# Altium schematic sheet MicroController.SchDoc
size OrCAD B; SheetNumber: 11; SheetTotal: 11
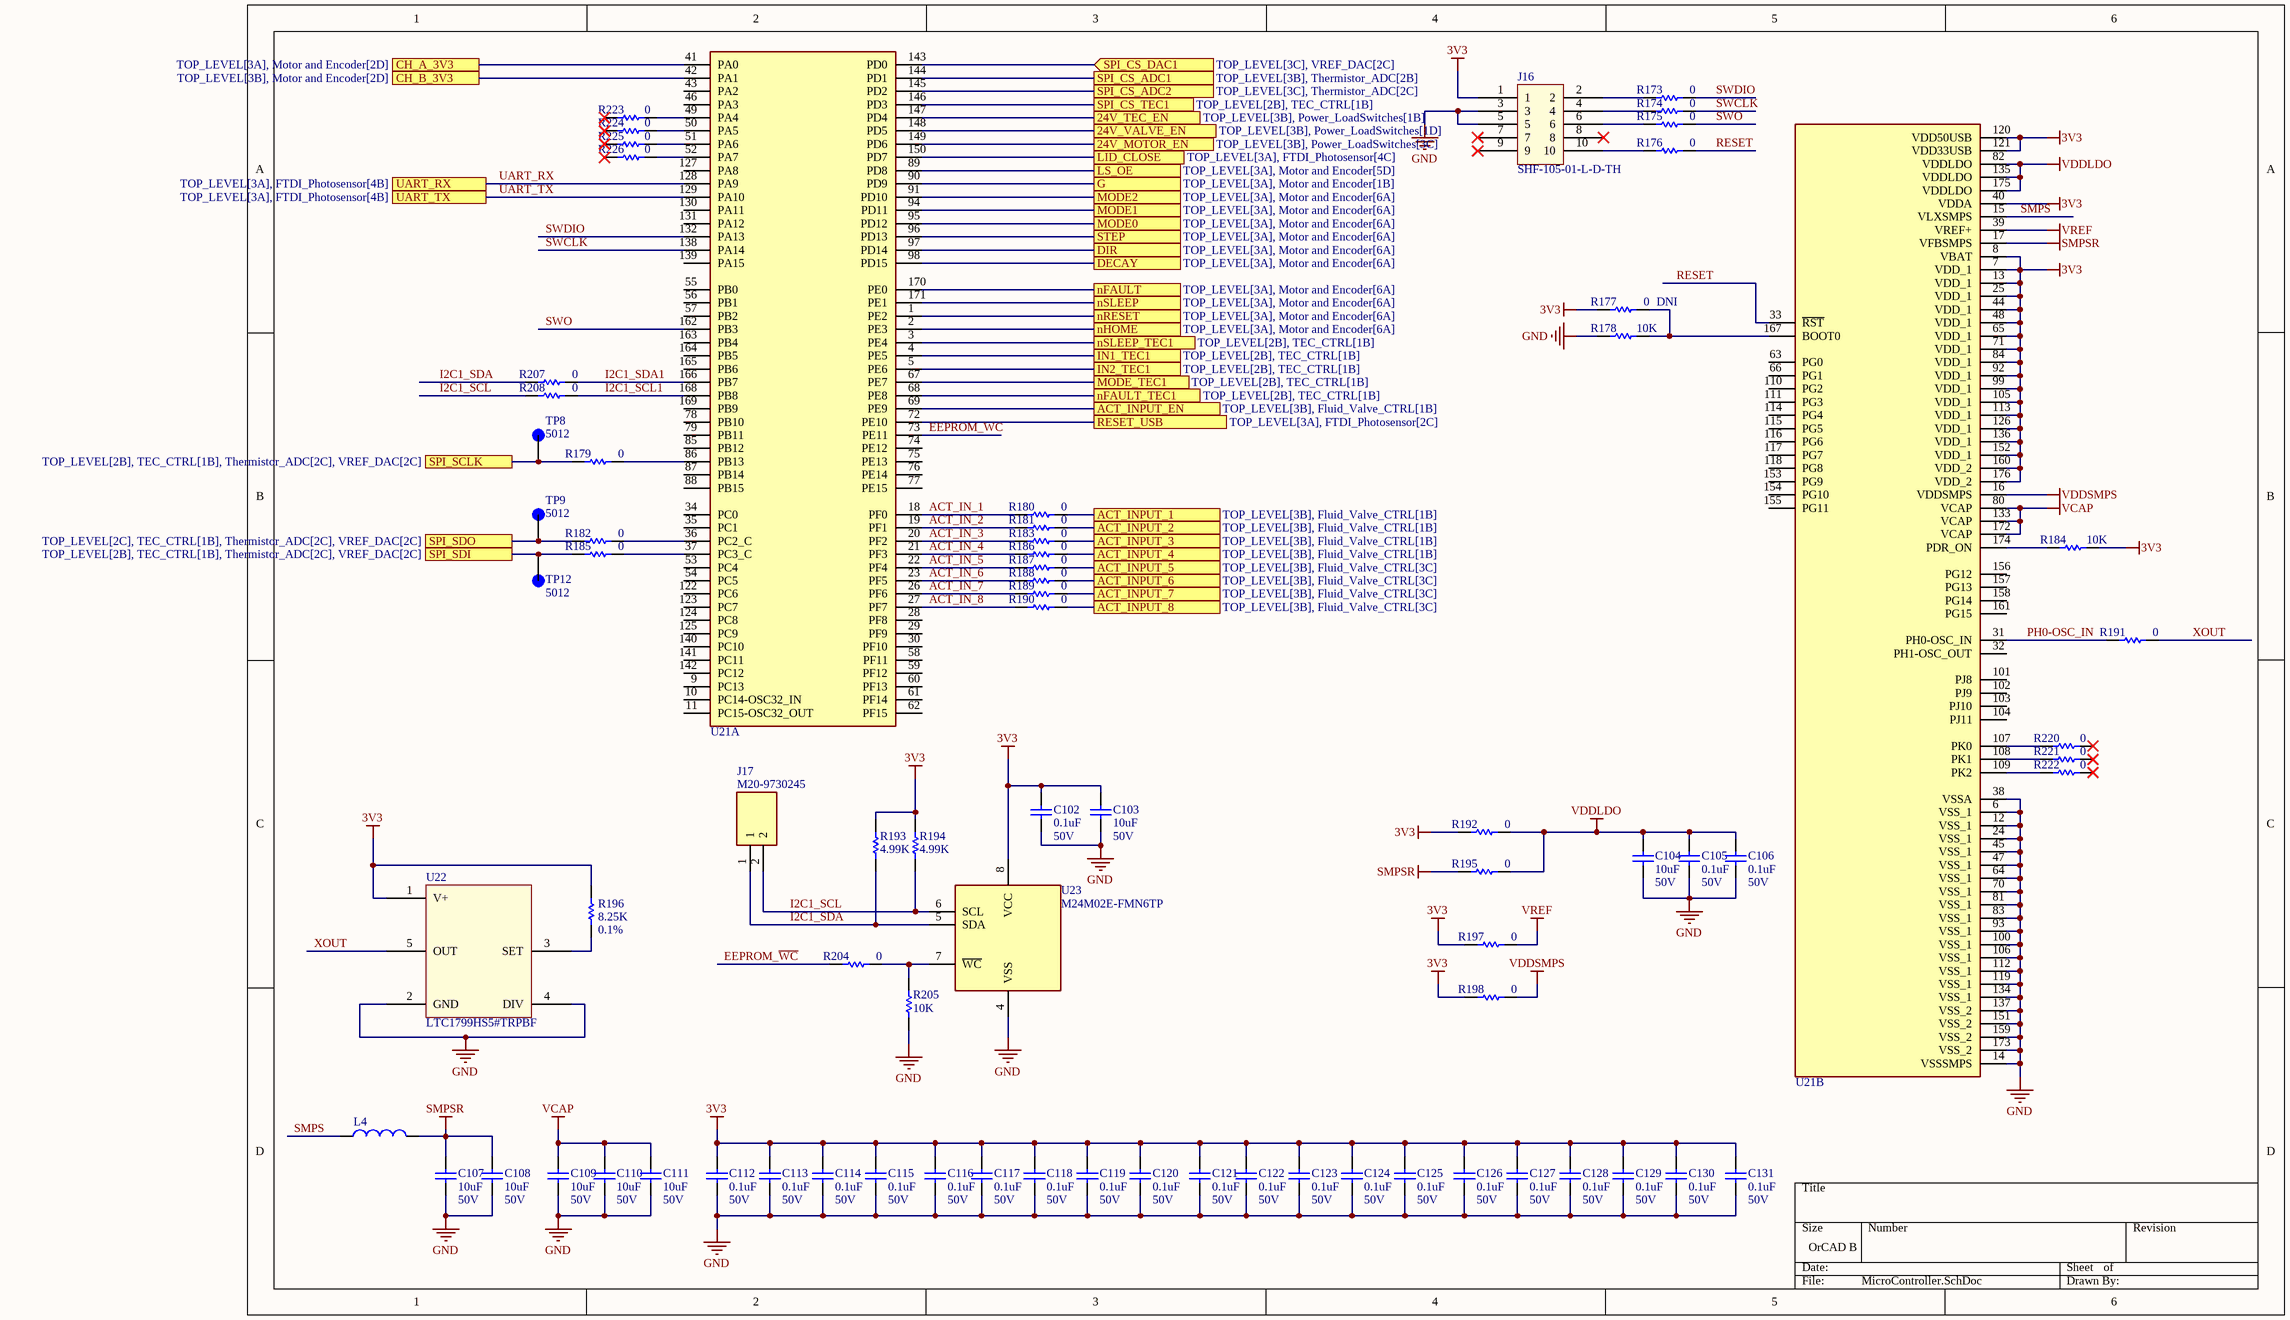
[diagram p0: MicroController.SchDoc]

## Parts
C102  value 0.1uF  Rating: 50V  [DEFAULT_CAPACITOR_0805]  (hidden comment: KGM21NR71H104KT)
C103  value 10uF  Rating: 50V  [DEFAULT_CAPACITOR_0805]  (hidden comment: GRM21BR61H106KE43L)
C104  value 10uF  Rating: 50V  [DEFAULT_CAPACITOR_0805]  (hidden comment: GRM21BR61H106KE43L)
C105  value 0.1uF  Rating: 50V  [DEFAULT_CAPACITOR_0805]  (hidden comment: KGM21NR71H104KT)
C106  value 0.1uF  Rating: 50V  [DEFAULT_CAPACITOR_0805]  (hidden comment: KGM21NR71H104KT)
C107  value 10uF  Rating: 50V  [DEFAULT_CAPACITOR_0805]  (hidden comment: GRM21BR61H106KE43L)
C108  value 10uF  Rating: 50V  [DEFAULT_CAPACITOR_0805]  (hidden comment: GRM21BR61H106KE43L)
C109  value 10uF  Rating: 50V  [DEFAULT_CAPACITOR_0805]  (hidden comment: GRM21BR61H106KE43L)
C110  value 10uF  Rating: 50V  [DEFAULT_CAPACITOR_0805]  (hidden comment: GRM21BR61H106KE43L)
C111  value 10uF  Rating: 50V  [DEFAULT_CAPACITOR_0805]  (hidden comment: GRM21BR61H106KE43L)
C112  value 0.1uF  Rating: 50V  [DEFAULT_CAPACITOR_0805]  (hidden comment: KGM21NR71H104KT)
C113  value 0.1uF  Rating: 50V  [DEFAULT_CAPACITOR_0805]  (hidden comment: KGM21NR71H104KT)
C114  value 0.1uF  Rating: 50V  [DEFAULT_CAPACITOR_0805]  (hidden comment: KGM21NR71H104KT)
C115  value 0.1uF  Rating: 50V  [DEFAULT_CAPACITOR_0805]  (hidden comment: KGM21NR71H104KT)
C116  value 0.1uF  Rating: 50V  [DEFAULT_CAPACITOR_0805]  (hidden comment: KGM21NR71H104KT)
C117  value 0.1uF  Rating: 50V  [DEFAULT_CAPACITOR_0805]  (hidden comment: KGM21NR71H104KT)
C118  value 0.1uF  Rating: 50V  [DEFAULT_CAPACITOR_0805]  (hidden comment: KGM21NR71H104KT)
C119  value 0.1uF  Rating: 50V  [DEFAULT_CAPACITOR_0805]  (hidden comment: KGM21NR71H104KT)
C120  value 0.1uF  Rating: 50V  [DEFAULT_CAPACITOR_0805]  (hidden comment: KGM21NR71H104KT)
C121  value 0.1uF  Rating: 50V  [DEFAULT_CAPACITOR_0805]  (hidden comment: KGM21NR71H104KT)
C122  value 0.1uF  Rating: 50V  [DEFAULT_CAPACITOR_0805]  (hidden comment: KGM21NR71H104KT)
C123  value 0.1uF  Rating: 50V  [DEFAULT_CAPACITOR_0805]  (hidden comment: KGM21NR71H104KT)
C124  value 0.1uF  Rating: 50V  [DEFAULT_CAPACITOR_0805]  (hidden comment: KGM21NR71H104KT)
C125  value 0.1uF  Rating: 50V  [DEFAULT_CAPACITOR_0805]  (hidden comment: KGM21NR71H104KT)
C126  value 0.1uF  Rating: 50V  [DEFAULT_CAPACITOR_0805]  (hidden comment: KGM21NR71H104KT)
C127  value 0.1uF  Rating: 50V  [DEFAULT_CAPACITOR_0805]  (hidden comment: KGM21NR71H104KT)
C128  value 0.1uF  Rating: 50V  [DEFAULT_CAPACITOR_0805]  (hidden comment: KGM21NR71H104KT)
C129  value 0.1uF  Rating: 50V  [DEFAULT_CAPACITOR_0805]  (hidden comment: KGM21NR71H104KT)
C130  value 0.1uF  Rating: 50V  [DEFAULT_CAPACITOR_0805]  (hidden comment: KGM21NR71H104KT)
C131  value 0.1uF  Rating: 50V  [DEFAULT_CAPACITOR_0805]  (hidden comment: KGM21NR71H104KT)
J16  SHF-105-01-L-D-TH  [SAMTEC-SHF-105-01-L-D-TH]
J17  M20-9730245  [M209730245]
L4  LQM2MPN2R2MG0L  [INDC2016X100N]  (value not drawn)
R173  value 0  [DEFAULT_RESISTOR_0805]  (hidden comment: RC0805JR-070RL)
R174  value 0  [DEFAULT_RESISTOR_0805]  (hidden comment: RC0805JR-070RL)
R175  value 0  [DEFAULT_RESISTOR_0805]  (hidden comment: RC0805JR-070RL)
R176  value 0  [DEFAULT_RESISTOR_0805]  (hidden comment: RC0805JR-070RL)
R177  DNI  value 0  [DEFAULT_RESISTOR_0805]
R178  value 10K  [DEFAULT_RESISTOR_0805]  (hidden comment: CRCW080510K0FKEA)
R179  value 0  [DEFAULT_RESISTOR_0805]  (hidden comment: RC0805JR-070RL)
R180  value 0  [DEFAULT_RESISTOR_0805]  (hidden comment: RC0805JR-070RL)
R181  value 0  [DEFAULT_RESISTOR_0805]  (hidden comment: RC0805JR-070RL)
R182  value 0  [DEFAULT_RESISTOR_0805]  (hidden comment: RC0805JR-070RL)
R183  value 0  [DEFAULT_RESISTOR_0805]  (hidden comment: RC0805JR-070RL)
R184  value 10K  [DEFAULT_RESISTOR_0805]  (hidden comment: CRCW080510K0FKEA)
R185  value 0  [DEFAULT_RESISTOR_0805]  (hidden comment: RC0805JR-070RL)
R186  value 0  [DEFAULT_RESISTOR_0805]  (hidden comment: RC0805JR-070RL)
R187  value 0  [DEFAULT_RESISTOR_0805]  (hidden comment: RC0805JR-070RL)
R188  value 0  [DEFAULT_RESISTOR_0805]  (hidden comment: RC0805JR-070RL)
R189  value 0  [DEFAULT_RESISTOR_0805]  (hidden comment: RC0805JR-070RL)
R190  value 0  [DEFAULT_RESISTOR_0805]  (hidden comment: RC0805JR-070RL)
R191  value 0  [DEFAULT_RESISTOR_0805]  (hidden comment: RC0805JR-070RL)
R192  value 0  [DEFAULT_RESISTOR_0805]  (hidden comment: RC0805JR-070RL)
R193  value 4.99K  [DEFAULT_RESISTOR_0805]  (hidden comment: RMCF0805FT4K99)
R194  value 4.99K  [DEFAULT_RESISTOR_0805]  (hidden comment: RMCF0805FT4K99)
R195  value 0  [DEFAULT_RESISTOR_0805]  (hidden comment: RC0805JR-070RL)
R196  value 8.25K  Tolerance: 0.1%  [DEFAULT_RESISTOR_0805]  (hidden comment: ERA-6AEB8251V)
R197  value 0  [DEFAULT_RESISTOR_0805]  (hidden comment: RC0805JR-070RL)
R198  value 0  [DEFAULT_RESISTOR_0805]  (hidden comment: RC0805JR-070RL)
R204  value 0  [DEFAULT_RESISTOR_0805]  (hidden comment: RC0805JR-070RL)
R205  value 10K  [DEFAULT_RESISTOR_0805]  (hidden comment: CRCW080510K0FKEA)
R207  value 0  [DEFAULT_RESISTOR_0805]  (hidden comment: RC0805JR-070RL)
R208  value 0  [DEFAULT_RESISTOR_0805]  (hidden comment: RC0805JR-070RL)
R220  value 0  [DEFAULT_RESISTOR_0805]  (hidden comment: RC0805JR-070RL)
R221  value 0  [DEFAULT_RESISTOR_0805]  (hidden comment: RC0805JR-070RL)
R222  value 0  [DEFAULT_RESISTOR_0805]  (hidden comment: RC0805JR-070RL)
R223  value 0  [DEFAULT_RESISTOR_0805]  (hidden comment: RC0805JR-070RL)
R224  value 0  [DEFAULT_RESISTOR_0805]  (hidden comment: RC0805JR-070RL)
R225  value 0  [DEFAULT_RESISTOR_0805]  (hidden comment: RC0805JR-070RL)
R226  value 0  [DEFAULT_RESISTOR_0805]  (hidden comment: RC0805JR-070RL)
TP8  5012  [TP_5011]
TP9  5012  [TP_5011]
TP12  5012  [TP_5011]
U21  STM32H735IGT6  [STM32H7351GT6-LQFP176]  (value not drawn)  (parts A,B of 2)
U22  LTC1799HS5#TRPBF  [LTC1799HS5-TSOT23-5]
U23  M24M02E-FMN6TP  [8ld - SOIC]

## Ports
24V_MOTOR_EN (see TOP_LEVEL[3B], Power_LoadSwitches[3C]), 24V_TEC_EN (see TOP_LEVEL[3B], Power_LoadSwitches[1B]), 24V_VALVE_EN (see TOP_LEVEL[3B], Power_LoadSwitches[1D]), ACT_INPUT_1 (see TOP_LEVEL[3B], Fluid_Valve_CTRL[1B]), ACT_INPUT_2 (see TOP_LEVEL[3B], Fluid_Valve_CTRL[1B]), ACT_INPUT_3 (see TOP_LEVEL[3B], Fluid_Valve_CTRL[1B]), ACT_INPUT_4 (see TOP_LEVEL[3B], Fluid_Valve_CTRL[1B]), ACT_INPUT_5 (see TOP_LEVEL[3B], Fluid_Valve_CTRL[3C]), ACT_INPUT_6 (see TOP_LEVEL[3B], Fluid_Valve_CTRL[3C]), ACT_INPUT_7 (see TOP_LEVEL[3B], Fluid_Valve_CTRL[3C]), ACT_INPUT_8 (see TOP_LEVEL[3B], Fluid_Valve_CTRL[3C]), ACT_INPUT_EN (see TOP_LEVEL[3B], Fluid_Valve_CTRL[1B]), CH_A_3V3 (see TOP_LEVEL[3A], Motor and Encoder[2D]), CH_B_3V3 (see TOP_LEVEL[3B], Motor and Encoder[2D]), DECAY (see TOP_LEVEL[3A], Motor and Encoder[6A]), DIR (see TOP_LEVEL[3A], Motor and Encoder[6A]), G (see TOP_LEVEL[3A], Motor and Encoder[1B]), IN1_TEC1 (see TOP_LEVEL[2B], TEC_CTRL[1B]), IN2_TEC1 (see TOP_LEVEL[2B], TEC_CTRL[1B]), LID_CLOSE (see TOP_LEVEL[3A], FTDI_Photosensor[4C]), LS_OE (see TOP_LEVEL[3A], Motor and Encoder[5D]), MODE0 (see TOP_LEVEL[3A], Motor and Encoder[6A]), MODE1 (see TOP_LEVEL[3A], Motor and Encoder[6A]), MODE2 (see TOP_LEVEL[3A], Motor and Encoder[6A]), MODE_TEC1 (see TOP_LEVEL[2B], TEC_CTRL[1B]), nFAULT (see TOP_LEVEL[3A], Motor and Encoder[6A]), nFAULT_TEC1 (see TOP_LEVEL[2B], TEC_CTRL[1B]), nHOME (see TOP_LEVEL[3A], Motor and Encoder[6A]), nRESET (see TOP_LEVEL[3A], Motor and Encoder[6A]), nSLEEP (see TOP_LEVEL[3A], Motor and Encoder[6A]), nSLEEP_TEC1 (see TOP_LEVEL[2B], TEC_CTRL[1B]), RESET_USB (see TOP_LEVEL[3A], FTDI_Photosensor[2C]), SPI_CS_ADC1 (see TOP_LEVEL[3B], Thermistor_ADC[2B]), SPI_CS_ADC2 (see TOP_LEVEL[3C], Thermistor_ADC[2C]), SPI_CS_DAC1 (in, see TOP_LEVEL[3C], VREF_DAC[2C]), SPI_CS_TEC1 (see TOP_LEVEL[2B], TEC_CTRL[1B]), SPI_SCLK (see TOP_LEVEL[2B], TEC_CTRL[1B], Thermistor_ADC[2C], VREF_DAC[2C]), SPI_SDI (see TOP_LEVEL[2B], TEC_CTRL[1B], Thermistor_ADC[2C], VREF_DAC[2C]), SPI_SDO (see TOP_LEVEL[2C], TEC_CTRL[1B], Thermistor_ADC[2C], VREF_DAC[2C]), STEP (see TOP_LEVEL[3A], Motor and Encoder[6A]), UART_RX (see TOP_LEVEL[3A], FTDI_Photosensor[4B]), UART_TX (see TOP_LEVEL[3A], FTDI_Photosensor[4B])

## Nets
3V3: C102.2 C103.2 C112.2 C113.2 C114.2 C115.2 C116.2 C117.2 C118.2 C119.2 C120.2 C121.2 C122.2 C123.2 C124.2 C125.2 C126.2 C127.2 C128.2 C129.2 C130.2 C131.2 J16.1 R177.2 R184.1 R192.2 R193.1 R194.1 R196.1 R197.2 R198.2 U21.7(VDD_1) U21.8(VBAT) U21.13(VDD_1) U21.25(VDD_1) U21.40(VDDA) U21.44(VDD_1) U21.48(VDD_1) U21.65(VDD_1) U21.71(VDD_1) U21.84(VDD_1) U21.92(VDD_1) U21.99(VDD_1) U21.105(VDD_1) U21.113(VDD_1) U21.120(VDD50USB) U21.121(VDD33USB) U21.126(VDD_1) U21.136(VDD_1) U21.152(VDD_1) U21.160(VDD_2) U21.176(VDD_2) U22.1(V+) U23.8(VCC)
GND: C102.1 C103.1 C104.1 C105.1 C106.1 C107.1 C108.1 C109.1 C110.1 C111.1 C112.1 C113.1 C114.1 C115.1 C116.1 C117.1 C118.1 C119.1 C120.1 C121.1 C122.1 C123.1 C124.1 C125.1 C126.1 C127.1 C128.1 C129.1 C130.1 C131.1 J16.3 J16.5 R178.2 R205.2 U21.6(VSS_1) U21.12(VSS_1) U21.14(VSSSMPS) U21.24(VSS_1) U21.38(VSSA) U21.45(VSS_1) U21.47(VSS_1) U21.64(VSS_1) U21.70(VSS_1) U21.81(VSS_1) U21.83(VSS_1) U21.93(VSS_1) U21.100(VSS_1) U21.106(VSS_1) U21.112(VSS_1) U21.119(VSS_1) U21.134(VSS_1) U21.137(VSS_2) U21.151(VSS_2) U21.159(VSS_2) U21.173(VSS_2) U22.2(GND) U22.4(DIV) U23.4(VSS)
SMPSR: C107.2 C108.2 L4.2 R195.2 U21.17(VFBSMPS)
VCAP: C109.2 C110.2 C111.2 U21.80(VCAP) U21.133(VCAP) U21.172(VCAP)
VDDLDO: C104.2 C105.2 C106.2 R192.1 R195.1 U21.82(VDDLDO) U21.135(VDDLDO) U21.175(VDDLDO)
VDDSMPS: R198.1 U21.16(VDDSMPS)
VREF: R197.1 U21.39(VREF+)
24V_MOTOR_EN: U21.149(PD6) ; port 24V_MOTOR_EN
24V_TEC_EN: U21.147(PD4) ; port 24V_TEC_EN
24V_VALVE_EN: U21.148(PD5) ; port 24V_VALVE_EN
ACT_IN_1: R180.2 U21.18(PF0)
ACT_IN_2: R181.2 U21.19(PF1)
ACT_IN_3: R183.2 U21.20(PF2)
ACT_IN_4: R186.2 U21.21(PF3)
ACT_IN_5: R187.2 U21.22(PF4)
ACT_IN_6: R188.2 U21.23(PF5)
ACT_IN_7: R189.2 U21.26(PF6)
ACT_IN_8: R190.2 U21.27(PF7)
ACT_INPUT_1: R180.1 ; port ACT_INPUT_1
ACT_INPUT_2: R181.1 ; port ACT_INPUT_2
ACT_INPUT_3: R183.1 ; port ACT_INPUT_3
ACT_INPUT_4: R186.1 ; port ACT_INPUT_4
ACT_INPUT_5: R187.1 ; port ACT_INPUT_5
ACT_INPUT_6: R188.1 ; port ACT_INPUT_6
ACT_INPUT_7: R189.1 ; port ACT_INPUT_7
ACT_INPUT_8: R190.1 ; port ACT_INPUT_8
ACT_INPUT_EN: U21.69(PE9) ; port ACT_INPUT_EN
CH_A_3V3: U21.41(PA0) ; port CH_A_3V3
CH_B_3V3: U21.42(PA1) ; port CH_B_3V3
DECAY: U21.98(PD15) ; port DECAY
DIR: U21.97(PD14) ; port DIR
EEPROM_~{WC}: R204.2 U21.73(PE11)
G: U21.90(PD9) ; port G
I2C1_SCL: J17.2 R194.2 R208.2 U23.6(SCL)
I2C1_SCL1: R208.1 U21.168(PB8)
I2C1_SDA: J17.1 R193.2 R207.2 U23.5(SDA)
I2C1_SDA1: R207.1 U21.166(PB7)
IN1_TEC1: U21.4(PE5) ; port IN1_TEC1
IN2_TEC1: U21.5(PE6) ; port IN2_TEC1
LID_CLOSE: U21.150(PD7) ; port LID_CLOSE
LS_OE: U21.89(PD8) ; port LS_OE
MODE0: U21.95(PD12) ; port MODE0
MODE1: U21.94(PD11) ; port MODE1
MODE2: U21.91(PD10) ; port MODE2
MODE_TEC1: U21.67(PE7) ; port MODE_TEC1
nFAULT: U21.170(PE0) ; port nFAULT
nFAULT_TEC1: U21.68(PE8) ; port nFAULT_TEC1
nHOME: U21.2(PE3) ; port nHOME
nRESET: U21.1(PE2) ; port nRESET
nSLEEP: U21.171(PE1) ; port nSLEEP
nSLEEP_TEC1: U21.3(PE4) ; port nSLEEP_TEC1
PH0-OSC_IN: R191.2 U21.31(PH0-OSC_IN)
RESET: R176.1 U21.33(~{RST})
RESET_USB: U21.72(PE10) ; port RESET_USB
SMPS: L4.1 U21.15(VLXSMPS)
SPI_CS_ADC1: U21.144(PD1) ; port SPI_CS_ADC1
SPI_CS_ADC2: U21.145(PD2) ; port SPI_CS_ADC2
SPI_CS_DAC1: U21.143(PD0) ; port SPI_CS_DAC1
SPI_CS_TEC1: U21.146(PD3) ; port SPI_CS_TEC1
SPI_SCLK: R179.2 TP8.TP ; port SPI_SCLK
SPI_SDI: R185.2 TP12.TP ; port SPI_SDI
SPI_SDO: R182.2 TP9.TP ; port SPI_SDO
STEP: U21.96(PD13) ; port STEP
SWCLK: R174.1 U21.138(PA14)
SWDIO: R173.1 U21.132(PA13)
SWO: R175.1 U21.162(PB3)
UART_RX: U21.128(PA9) ; port UART_RX
UART_TX: U21.129(PA10) ; port UART_TX
XOUT: R191.1 U22.5(OUT)
NetJ16_2: J16.2 R173.2
NetJ16_4: J16.4 R174.2
NetJ16_6: J16.6 R175.2
NetJ16_10: J16.10 R176.2
NetR177_1: R177.1 R178.1 U21.167(BOOT0)
NetR179_1: R179.1 U21.86(PB13)
NetR182_1: R182.1 U21.36(PC2_C)
NetR184_2: R184.2 U21.174(PDR_ON)
NetR185_1: R185.1 U21.37(PC3_C)
NetR196_2: R196.2 U22.3(SET)
NetR204_1: R204.1 R205.1 U23.7(~{WC})
NetR220_2: R220.2 U21.107(PK0)
NetR221_2: R221.2 U21.108(PK1)
NetR222_2: R222.2 U21.109(PK2)
NetR223_1: R223.1 U21.49(PA4)
NetR224_1: R224.1 U21.50(PA5)
NetR225_1: R225.1 U21.51(PA6)
NetR226_1: R226.1 U21.52(PA7)

Not connected (* = marked no-connect by the designer): J16 7* 8* 9*; R220 1*; R221 1*; R222 1*; R223 2*; R224 2*; R225 2*; R226 2*; U21 9(PC13) 10(PC14-OSC32_IN) 11(PC15-OSC32_OUT) 28(PF8) 29(PF9) 30(PF10) 32(PH1-OSC_OUT) 34(PC0) 35(PC1) 43(PA2) 46(PA3) 53(PC4) 54(PC5) 55(PB0) 56(PB1) 57(PB2) 58(PF11) 59(PF12) 60(PF13) 61(PF14) 62(PF15) 63(PG0) 66(PG1) 74(PE12) 75(PE13) 76(PE14) 77(PE15) 78(PB10) 79(PB11) 85(PB12) 87(PB14) 88(PB15) 101(PJ8) 102(PJ9) 103(PJ10) 104(PJ11) 110(PG2) 111(PG3) 114(PG4) 115(PG5) 116(PG6) 117(PG7) 118(PG8) 122(PC6) 123(PC7) 124(PC8) 125(PC9) 127(PA8) 130(PA11) 131(PA12) 139(PA15) 140(PC10) 141(PC11) 142(PC12) 153(PG9) 154(PG10) 155(PG11) 156(PG12) 157(PG13) 158(PG14) 161(PG15) 163(PB4) 164(PB5) 165(PB6) 169(PB9); U23 1(NC) 2(NC) 3(NC)

## Library data of the parts
C102 C105 C106 C112-C131 = KGM21NR71H104KT: CAP CER 0.1UF 50V X7R 0805; Manufacturer: Cal-Chip Electronics, Inc.; Manufacturer P/N: GMC55X7R226M50NT; MFR PN: KGM21NR71H104KT
C103 C104 C107-C111 = GRM21BR61H106KE43L: CAP CER 10UF 50V X5R 0805; MFR PN: GRM21BR61H106KE43L
J16 = SHF-105-01-L-D-TH: CONN HEADER VERT 10POS 1.27MM; Manufacturer: Sametc; MFR PN: SHF-105-01-L-D-TH; Manufacturer P/N: SHF-105-01-L-D-TH
J17 = M20-9730245: M20: 2 Pos Plug SIL Straight 3mm THT Connector 7mm pin Gold; Manufacturer_Name: Harwin; Geometry.Height: 9.54mm; Manufacturer_Part_Number: M20-9730245; Mouser Part Number: 855-M20-9730245; Mouser Price/Stock: https://www.mouser.co.uk/ProductDetail/Harwin/M20-9730245?qs=%252Bk6%2F5FB6qrkOd7%252Bh6nj7DA%3D%3D; Arrow Part Number: *; Arrow Price/Stock: *; Datasheet Link: https://content.harwin.com/m/d105a7681d963845/original/DRG-00452-Technical-Drawing-Datasheet-M20-973-pdf.pdf; MFR PN: M20-9730245
L4 = LQM2MPN2R2MG0L: Inductor with Inductance: 2.2uH Tol. +/-20%, Package: 0806 (2016); Value: 2.2uH; MFR PN: LQM2MPN2R2MG0L
R173-R177 R179-R183 R185-R192 R195 R197 R198 R204 R207 R208 R220-R226 = RC0805JR-070RL: RES 0 OHM JUMPER 1/8W 0805; Power: 1/8W; MFR PN: RC0805JR-070RL; Tolerance: *
R178 R184 R205 = CRCW080510K0FKEA: RES SMD 10K OHM 1% 1/4W 0805; Power: 1/4W; MFR PN: CRCW080510K0FKEA; Tolerance: 1%
R193 R194 = RMCF0805FT4K99: RES 4.99K OHM 1% 1/8W 0805; Power: 1/8W; MFR PN: RMCF0805FT4K99; Tolerance: 1%
R196 = ERA-6AEB8251V: RES SMD 8.25K OHM 0.1% 1/8W 0805; Power: 1/8W; MFR PN: ERA-6AEB8251V
TP8 TP9 TP12 = 5012: PC TEST POINT MULTIPURPOSE WHITE; MFR PN: 5012
U21 = STM32H735IGT6: ARM® Cortex®-M7 STM32H7 Microcontroller IC 32-Bit 550MHz 1MB (1M x 8) FLASH 176-LQFP (24x24); Manufacturer: STMicroelectronics; Manufacturer P/N: STM32H735IGT6; MFR PN: STM32H735IGT6
U22 = LTC1799HS5#TRPBF: IC OSC SILICON PROG TSOT23-5; Manufacturer: Analog Devices; MFR PN: LTC1799HS5#TRPBF; Manufacturer P/N: LTC1799HS5#TRPBF
U23 = M24M02E-FMN6TP: EEPROM Memory IC 2Mbit I2C 1 MHz 450 ns 8-SO; Designer: OMIGA; MP: M24M02E-FMN; MFR PN: M24M02E-FMN6TP